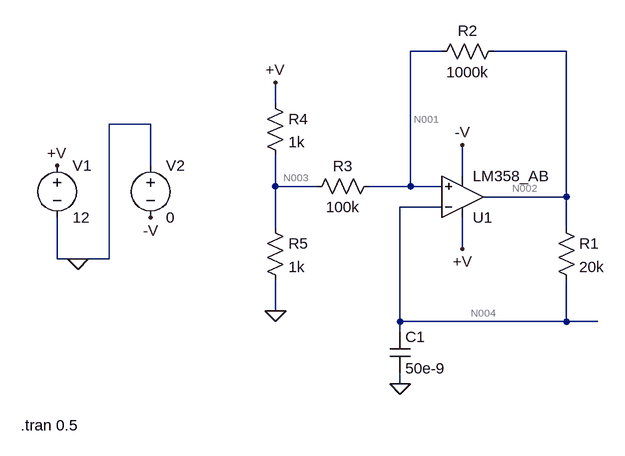
[diagram p0: schematic ГЛИН.asc]
ГЛИН.asc, the LTspice schematic file:
Version 4
SHEET 1 1232 680
WIRE 688 -64 640 -64
WIRE 880 -64 768 -64
WIRE 432 16 432 -16
WIRE 240 48 176 48
WIRE 240 112 240 48
WIRE 720 128 720 80
WIRE 432 144 432 96
WIRE 496 144 432 144
WIRE 640 144 640 -64
WIRE 640 144 576 144
WIRE 688 144 640 144
WIRE 880 160 880 -64
WIRE 880 160 752 160
WIRE 688 176 624 176
WIRE 432 208 432 144
WIRE 880 208 880 160
WIRE 720 240 720 192
WIRE 96 256 96 192
WIRE 128 256 96 256
WIRE 176 256 176 48
WIRE 176 256 128 256
WIRE 432 336 432 288
WIRE 624 352 624 176
WIRE 880 352 880 288
WIRE 880 352 624 352
WIRE 928 352 880 352
WIRE 624 368 624 352
WIRE 624 448 624 432
FLAG 96 112 +V
FLAG 240 192 -V
FLAG 128 256 0
FLAG 720 240 +V
FLAG 720 80 -V
FLAG 624 448 0
FLAG 432 336 0
FLAG 432 -16 +V
SYMBOL voltage 96 96 R0
SYMATTR InstName V1
SYMATTR Value 12
SYMBOL voltage 240 96 R0
SYMATTR InstName V2
SYMATTR Value 0
SYMBOL res 864 192 R0
SYMATTR InstName R1
SYMATTR Value 20k
SYMBOL cap 608 368 R0
SYMATTR InstName C1
SYMATTR Value 50e-9
SYMBOL res 784 -80 R90
WINDOW 0 0 56 VBottom 2
WINDOW 3 32 56 VTop 2
SYMATTR InstName R2
SYMATTR Value 1000k
SYMBOL res 592 128 R90
WINDOW 0 0 56 VBottom 2
WINDOW 3 32 56 VTop 2
SYMATTR InstName R3
SYMATTR Value 100k
SYMBOL res 416 0 R0
SYMATTR InstName R4
SYMATTR Value 1k
SYMBOL res 416 192 R0
SYMATTR InstName R5
SYMATTR Value 1k
SYMBOL ZZZ\\OpAmp\\LM358_AB 720 224 M180
SYMATTR InstName U1
TEXT 40 512 Left 2 !.tran 0.5

The netlist it stands for:
* ГЛИН.asc
V1 +V 0 12
V2 0 -V 0
R1 N002 N004 20k
C1 N004 0 50e-9
R2 N002 N001 1000k
R3 N001 N003 100k
R4 +V N003 1k
R5 N003 0 1k
* U1: LM358_AB (symbol ZZZ\OpAmp\LM358_AB not available, pins judged from their places): In+=N001 In-=N004 V+=+V V-=-V OUT=N002
.tran 0.5
.backanno
.end

* Results of the author's LTspice run, read from the files saved beside the schematic
* Operating Point, zero values left out:
*   V(+v) = 12 V
*   V(n002) = 6.004 V
*   V(n004) = 6.005 V
*   V(n001) = 6.005 V
*   V(n003) = 6 V
*   I(R5) = 6 mA
*   I(R4) = 6 mA
*   I(R3) = 46.42 nA
*   I(R2) = -1.056 nA
*   I(R1) = -48.87 nA
*   I(V2) = -357.8 µA
*   I(V1) = -6.358 mA
*   Ix(u1:IN+) = -47.48 nA
*   Ix(u1:IN-) = -48.87 nA
*   Ix(u1:VCC) = 357.9 µA
*   Ix(u1:VSS) = -357.8 µA
*   Ix(u1:OUT) = 49.93 nA